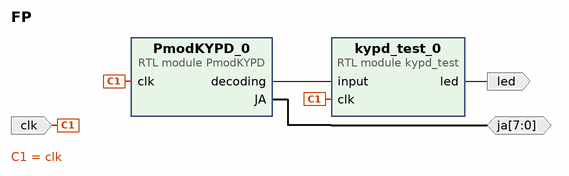
[diagram p0: block diagram of the top level]
# Vivado block design FP, xc7z010clg400-1, Vivado 2021.1
create_bd_design FP

create_bd_port -dir I -type clk clk
create_bd_port -dir IO -from 7 -to 0 ja
create_bd_port -dir O led

create_bd_cell -type module -reference PmodKYPD PmodKYPD_0
create_bd_cell -type module -reference kypd_test kypd_test_0

# ---- connections ----

connect_bd_net [get_bd_ports ja] [get_bd_pins PmodKYPD_0/JA]
connect_bd_net [get_bd_pins PmodKYPD_0/decoding] [get_bd_pins kypd_test_0/input]
connect_bd_net -net clk_0_1 [get_bd_ports clk] [get_bd_pins PmodKYPD_0/clk] [get_bd_pins kypd_test_0/clk]
connect_bd_net [get_bd_pins kypd_test_0/led] [get_bd_ports led]

validate_bd_design
save_bd_design
